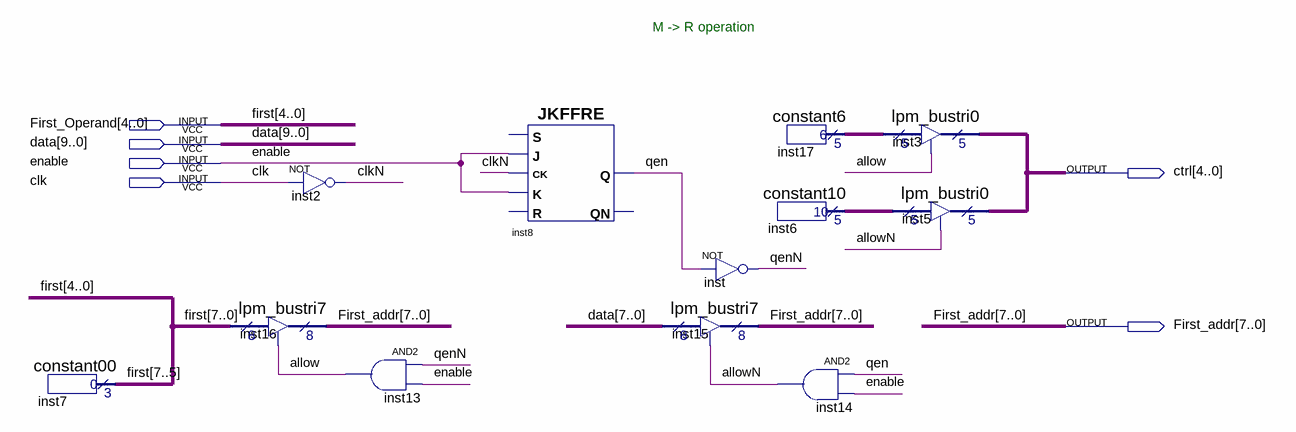
[diagram p0: schematic sheet]
// Quartus schematic R-M_Operation.bdf as structural Verilog: 12 symbols, 6 pins
module \R-M_Operation  (
  input  [4:0] First_Operand,
  input  [9:0] data,
  input  enable,
  input  clk,
  output [4:0] ctrl,
  output [7:0] First_addr
);

  wire allow, allowN, clkN, qen, qenN;
  wire [4:0] inst6_result, inst17_result;
  wire [7:5] first;

  constant00 inst7 (.result(first));
  lpm_bustri7 inst16 (.enabledt(allow), .data({first, First_Operand}), .tridata(First_addr));
  not inst2 (clkN, clk);
  and inst13 (allow, qenN, enable);
  JKFFRE inst8 (.K(enable), .CK(clkN), .J(enable), .Q(qen));  // open: R, S, QN
  not inst (qenN, qen);
  lpm_bustri7 inst15 (.enabledt(allowN), .data(data[7:0]), .tridata(First_addr));
  constant6 inst17 (.result(inst17_result));
  constant10 inst6 (.result(inst6_result));
  and inst14 (allowN, qen, enable);
  lpm_bustri0 inst3 (.enabledt(allow), .data(inst17_result), .tridata(ctrl));
  lpm_bustri0 inst5 (.enabledt(allowN), .data(inst6_result), .tridata(ctrl));

  // Other names for the same wires on the sheet: first[4:0] = First_Operand

  // Notes on the sheet:
  //   M -> R operation
endmodule
